# Altium schematic sheet Isolated-Power-Section.SchDoc
size A4; DocumentNumber: 3; SheetNumber: 3; SheetTotal: 10
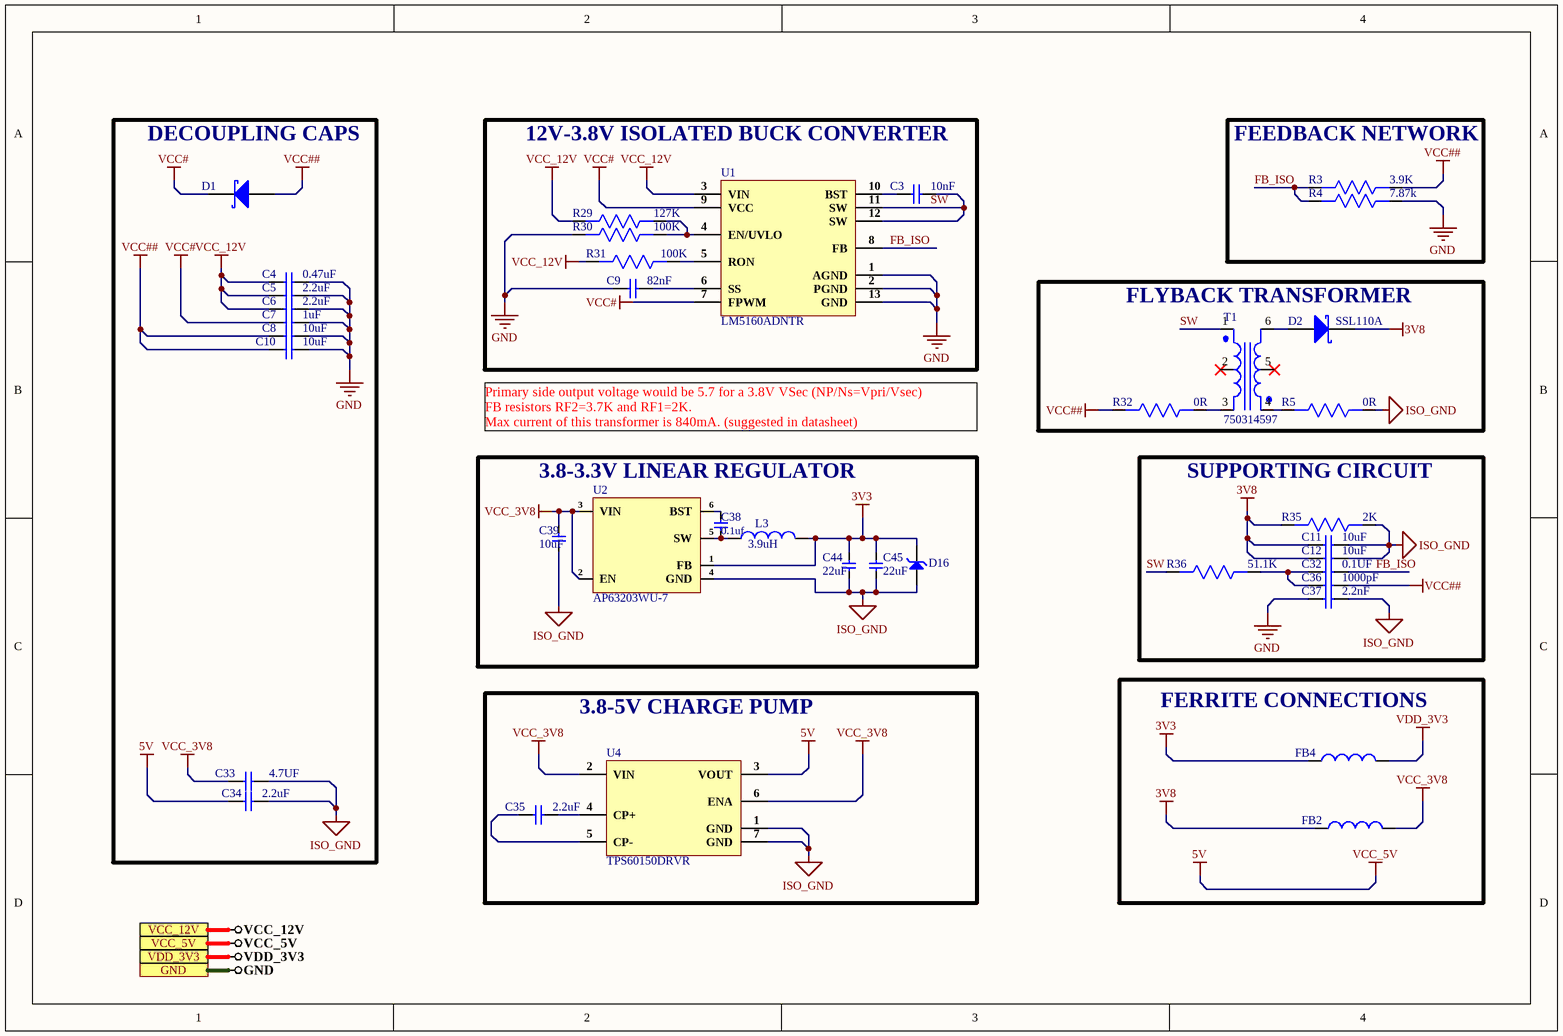
[diagram p0: Isolated-Power-Section.SchDoc]

## Parts
C3  10nF  [Cap 0402]
C4  0.47uF  [Cap 0402]
C5  2.2uF  [Cap 0603]
C6  2.2uF  [Cap 0603]
C7  1uF  [Cap 0603]
C8  10uF  [Cap 0603]
C9  82nF  [Cap 0603]
C10  10uF  [Cap 0603]
C11  10uF  [Cap 0603]
C12  10uF  [Cap 0603]
C32  0.1UF  [Cap 0402]
C33  4.7UF  [Cap 0603]
C34  2.2uF  [Cap 0603]
C35  2.2uF  [Cap 0603]
C36  1000pF  [Cap 0402]
C37  2.2nF  [Cap 0603]
C38  0.1uf  [Cap-0402]
C39  10uF  [Cap-0603]
C44  22uF  [Cap-0805]
C45  22uF  [Cap-0805]
D1  CUS10S30,H3F  [CUS10S30,H3F]  (value not drawn)
D2  SSL110A  [SMA]
D16  MSP3V3HM3/89A  [MicroSMP]  (value not drawn)
FB2  MPZ1608S121ATDH5  [MPZ1608S121ATDH5]  (value not drawn)
FB4  MPZ1608S121ATDH5  [MPZ1608S121ATDH5]  (value not drawn)
L3  3.9uH  [FNR3015S3R9MT]
R3  3.9K  [Res0603]
R4  7.87k  [Res0603]
R5  0R  [Res0603]
R29  127K  [Res0603]
R30  100K  [Res0603]
R31  100K  [Res0603]
R32  0R  [Res0603]
R35  2K  [Res0603]
R36  51.1K  [Res0603]
T1  750314597  [750314597]
U1  LM5160ADNTR  [LM5160ADNTR]
U2  AP63203WU-7  [TSOT-23-6]
U4  TPS60150DRVR  [TPS60150DRVR]

## Blocks framed on the sheet
DECOUPLING CAPS: C4-C8 C10 C33 C34 D1
12V-3.8V ISOLATED BUCK CONVERTER: C3 C9 R29-R31 U1
FEEDBACK NETWORK: R3 R4
FLYBACK TRANSFORMER: D2 R5 R32 T1
3.8-3.3V LINEAR REGULATOR: C38 C39 C44 C45 D16 L3 U2
SUPPORTING CIRCUIT: C11 C12 C32 C36 C37 R35 R36
3.8-5V CHARGE PUMP: C35 U4
FERRITE CONNECTIONS: FB2 FB4

## Ports
GND, VCC_5V, VCC_12V, VDD_3V3

## Nets
3V3: C44.2 C45.2 D16.2(K) FB4.1 L3.2 U2.1(FB)
3V8: C11.1 C12.1 D2.1(K) FB2.1 R35.2
5V: C34.1 U4.3(VOUT) ; port VCC_5V  [also labelled VCC_5V]
GND: C4.2 C5.2 C6.2 C7.2 C8.2 C9.1 C10.2 C37.1 R4.1 R30.2 U1.1(AGND) U1.2(PGND) U1.13(GND) ; port GND
ISO_GND: C11.2 C12.2 C33.2 C34.2 C37.2 C39.1 C44.1 C45.1 D16.1(A) R5.1 R35.1 U2.4(GND) U4.1(GND) U4.7(GND)
VCC#: C7.1 D1.1(K) U1.7(FPWM) U1.9(VCC)
VCC##: C8.1 C10.1 C36.2 D1.2(A) R3.1 R32.2
VCC_3V8: C33.1 C39.2 FB2.2 U2.2(EN) U2.3(VIN) U4.2(VIN) U4.6(ENA)
VCC_12V: C4.1 C5.1 C6.1 R29.2 R31.2 U1.3(VIN) ; port VCC_12V
VDD_3V3: FB4.2 ; port VDD_3V3
FB_ISO: C32.2 R3.2 R4.2 U1.8(FB)
SW: C3.2 R36.2 T1.1(PRI_1) U1.11(SW) U1.12(SW)
NetC3_1: C3.1 U1.10(BST)
NetC9_2: C9.2 U1.6(SS)
NetC32_1: C32.1 C36.1 R36.1
NetC35_1: C35.1 U4.5(CP-)
NetC35_2: C35.2 U4.4(CP+)
NetC38_1: C38.1 L3.1 U2.5(SW)
NetC38_2: C38.2 U2.6(BST)
NetD2_2: D2.2(A) T1.6(SEC_2)
NetR5_2: R5.2 T1.4(SEC_1)
NetR29_1: R29.1 R30.1 U1.4(EN/UVLO)
NetR31_1: R31.1 U1.5(RON)
NetR32_1: R32.1 T1.3(PRI_2)

Not connected (* = marked no-connect by the designer): T1 2(NC)* 5(NC)*

## Notes on the sheet
- Primary side output voltage would be 5.7 for a 3.8V VSec (NP/Ns=Vpri/Vsec)
  FB resistors RF2=3.7K and RF1=2K.
  Max current of this transformer is 840mA. (suggested in datasheet)

## Library data of the parts
C3 = CC0402KRX7R8BB103: CAP CER 10000PF 25V X7R 0402; Manufacturer: Yageo; Tolerance: 10%; Supplier 1: Digi-Key; Manufacturer Part Number: CC0402KRX7R8BB103; Stock 1: 0; Pricing 1: 1=0.1, 10=0.021, 100=0.0093, 500=0.00666, 1000=0.00523, 2500=0.00476, 5000=0.00438 (USD); Mount: Surface Mount; Case/Package: 0402; Case Code (Metric): 1005; Case Code (Imperial): 0402; Min Operating Temperature: -55°C; Max Operating Temperature: 125°C; Capacitance: 10nF; Dielectric: X7R; Voltage Rating: 25V; Package Quantity: 1; Packaging: Tape and Reel; Voltage Rating (DC): 25V; Termination: SMD/SMT; Composition: Ceramic; Length: 1mm; Height: 0.5mm; Depth: 0.5mm; Width: 0.02inch; Thickness: 0.022inch; Radiation Hardening: No; REACH SVHC: Unknown; Lead Free: Lead Free; Halogen Free: Halogen Free; ComponentLink1URL: http://www.yageo.com/documents/recent/UPY-GPHC_X7R_6.3V-to-50V_18.pdf?src-supplier=Digi-Key; ComponentLink1Description: http://www.yageo.com/documents/recent/UPY-GPHC_X7R_6.3V-to-50V_18.pdf?src-supplier=Digi-Key; ComponentLink2URL: https://www.verical.com/server-webapp/html/getDatasheet?partID=375418&src-supplier=Verical; ComponentLink2Description: https://www.verical.com/server-webapp/html/getDatasheet?partID=375418&src-supplier=Verical; ComponentLink3URL: http://www.yageo.com/documents/recent/UPY-GPHC_X7R_6.3V-to-50V_8.pdf?src-supplier=Avnet; ComponentLink3Description: http://www.yageo.com/documents/recent/UPY-GPHC_X7R_6.3V-to-50V_8.pdf?src-supplier=Avnet; ComponentLink4URL: https://4donline.ihs.com/images/VipMasterIC/IC/YAGO/YAGO-S-A0003557223/YAGO-S-A0003557223-1.pdf?hkey=52A5661711E402568146F3353EA87419&src-supplier=Element14; ComponentLink4Description: https://4donline.ihs.com/images/VipMasterIC/IC/YAGO/YAGO-S-A0003557223/YAGO-S-A0003557223-1.pdf?hkey=52A5661711E402568146F3353EA87419&src-supplier=Element14; ComponentLink5URL: http://www.farnell.com/datasheets/2167236.pdf?src-supplier=Element14; ComponentLink5Description: http://www.farnell.com/datasheets/2167236.pdf?src-supplier=Element14; ComponentLink6URL: http://www.mouser.com/ds/2/447/Yageo_UPY-GP_NP0_16V-to-50V_9-358835.pdf?src-supplier=Mouser; ComponentLink6Description: http://www.mouser.com/ds/2/447/Yageo_UPY-GP_NP0_16V-to-50V_9-358835.pdf?src-supplier=Mouser; Supplier Part Number 1: 311-1337-1-ND
C4 = UMK105ABJ474KV-F: CAP CER 0.47UF 50V X5R 0402; Manufacturer: Taiyo Yuden; Capacitance: 470nF; Tolerance: 10%; Supplier 1: Digi-Key; Manufacturer Part Number: UMK105ABJ474KV-F; RoHS: Yes; Category: Ceramic Capacitors; Stock 1: 145003; Pricing 1: 1=0.24000, 10=0.16100, 50=0.09680, 100=0.08170, 500=0.05592, 1000=0.04946, 2500=0.04731, 5000=0.04301 (USD); Mount: Surface Mount; Case/Package: 0402; Case Code (Metric): 1005; Case Code (Imperial): 0402; Min Operating Temperature: -55°C; Max Operating Temperature: 85°C; Package Quantity: 10000; Packaging: Tape and Reel; Voltage Rating: 50V; Voltage Rating (DC): 50V; Dielectric: X5R; Termination: SMD/SMT; Length: 0.039inch; Width: 0.02inch; Height: 0.5mm; Thickness: 0.022inch; Lead Free: Lead Free; RoHS Compliant: Yes; ComponentLink1URL: https://datasheet.ciiva.com/30249/584umk105abj474kv-f-30249824.pdf?src-supplier=Onlinecomponents.com; ComponentLink1Description: https://datasheet.ciiva.com/30249/584umk105abj474kv-f-30249824.pdf?src-supplier=Onlinecomponents.com; ComponentLink2URL: https://datasheet.ciiva.com/24370/10umk105abj474kv-f-24370678.pdf?src-supplier=Onlinecomponents.com; ComponentLink2Description: https://datasheet.ciiva.com/24370/10umk105abj474kv-f-24370678.pdf?src-supplier=Onlinecomponents.com; ComponentLink3URL: https://datasheet.ciiva.com/18697/mlcc-all-e-18697429.pdf?src-supplier=Digi-Key; ComponentLink3Description: https://datasheet.ciiva.com/18697/mlcc-all-e-18697429.pdf?src-supplier=Digi-Key; ComponentLink4URL: https://datasheet.ciiva.com/18697/mlcc-all-e-18697430.pdf?src-supplier=Digi-Key; ComponentLink4Description: https://datasheet.ciiva.com/18697/mlcc-all-e-18697430.pdf?src-supplier=Digi-Key; ComponentLink5URL: https://datasheet.ciiva.com/18697/mlcc-all-e-18697431.pdf?src-supplier=Digi-Key; ComponentLink5Description: https://datasheet.ciiva.com/18697/mlcc-all-e-18697431.pdf?src-supplier=Digi-Key; Supplier Part Number 1: 587-3497-1-ND
C5 C6 C34 C35 = GRM188R6YA225KA12D: CAP, 2.2µF, 35V, 10%, X5R, 0603; Manufacturer: Murata; Material: Ceramic; Supplier 1: Digi-Key; Manufacturer Part Number: GRM188R6YA225KA12D; RoHS: Yes; Category: Ceramic Capacitors; Stock 1: 81665; Pricing 1: 1=0.21000, 10=0.14100, 50=0.08480, 100=0.07170, 500=0.04904, 1000=0.04338 (USD); Mount: Surface Mount; Case/Package: 0603; Case Code (Metric): 1608; Case Code (Imperial): 0603; Weight: 0.000222oz; Min Operating Temperature: -55°C; Max Operating Temperature: 85°C; Package Quantity: 4000; Packaging: Tape and Reel; Capacitance: 2.2uF; Tolerance: 10%; Voltage Rating: 35V; Dielectric: X5R; Voltage: 35V; Termination: SMD/SMT; Voltage Rating (DC): 35V; Series: GRM; Length: 1.6mm; Width: 0.8mm; Height: 0.8mm; Thickness: 0.035inch; Depth: 0.8mm; REACH SVHC: No SVHC; Lead Free: Lead Free; RoHS Compliant: Yes; ComponentLink1URL: https://datasheet.ciiva.com/14906/partnumbering-e-01-14906490.pdf?src-supplier=Digi-Key; ComponentLink1Description: https://datasheet.ciiva.com/14906/partnumbering-e-01-14906490.pdf?src-supplier=Digi-Key; ComponentLink2URL: https://datasheet.ciiva.com/14906/partnumbering-e-01-14906491.pdf?src-supplier=Digi-Key; ComponentLink2Description: https://datasheet.ciiva.com/14906/partnumbering-e-01-14906491.pdf?src-supplier=Digi-Key; ComponentLink3URL: https://datasheet.ciiva.com/14906/partnumbering-e-01-14906492.pdf?src-supplier=Digi-Key; ComponentLink3Description: https://datasheet.ciiva.com/14906/partnumbering-e-01-14906492.pdf?src-supplier=Digi-Key; Supplier Part Number 1: 490-7204-1-ND
C7 = CC0603KRX5R8BB105: CAP CER 1UF 25V X5R 0603; Manufacturer: Yageo; Tolerance: 10%; Supplier 1: Digi-Key; Manufacturer Part Number: CC0603KRX5R8BB105; RoHS: Yes; Category: Ceramic Capacitors; Stock 1: 919939; Pricing 1: 1=0.12000, 10=0.08400, 50=0.04760, 100=0.03940, 500=0.02764, 1000=0.02288 (USD); Mount: Surface Mount; Case/Package: 0603; Number of Pins: 2; Case Code (Metric): 1608; Case Code (Imperial): 0603; Min Operating Temperature: -55°C; Max Operating Temperature: 85°C; Capacitance: 1uF; Dielectric: X5R; Package Quantity: 1; Voltage Rating: 25V; Packaging: Tape and Reel; Termination: SMD/SMT; Voltage Rating (DC): 25V; Series: CC; Construction: Flat; Length: 1.6mm; Width: 0.031inch; Height: 0.8mm; Thickness: 0.035inch; Depth: 0.8mm; Radiation Hardening: No; REACH SVHC: No SVHC; Lead Free: Lead Free; Halogen Free: Halogen Free; RoHS Compliant: Yes; ComponentLink1URL: https://datasheet.ciiva.com/176/mlccorderingcode-176785.pdf?src-supplier=Digi-Key; ComponentLink1Description: https://datasheet.ciiva.com/176/mlccorderingcode-176785.pdf?src-supplier=Digi-Key; ComponentLink2URL: https://datasheet.ciiva.com/176/mlccorderingcode-176786.pdf?src-supplier=Digi-Key; ComponentLink2Description: https://datasheet.ciiva.com/176/mlccorderingcode-176786.pdf?src-supplier=Digi-Key; ComponentLink3URL: https://datasheet.ciiva.com/176/mlccorderingcode-176787.pdf?src-supplier=Digi-Key; ComponentLink3Description: https://datasheet.ciiva.com/176/mlccorderingcode-176787.pdf?src-supplier=Digi-Key; ComponentLink4URL: https://datasheet.ciiva.com/17436/upy-gphc-x5r-4v-to-50v-12-17436952.pdf?src-supplier=Avnet+Europe; ComponentLink4Description: https://datasheet.ciiva.com/17436/upy-gphc-x5r-4v-to-50v-12-17436952.pdf?src-supplier=Avnet+Europe; ComponentLink5URL: https://datasheet.ciiva.com/7978/1525783-7978171.pdf?src-supplier=Element14; ComponentLink5Description: https://datasheet.ciiva.com/7978/1525783-7978171.pdf?src-supplier=Element14; ComponentLink6URL: https://datasheet.ciiva.com/11586/upy-gphc-x5r-4v-to-50v-12-11586318.pdf?src-supplier=Avnet; ComponentLink6Description: https://datasheet.ciiva.com/11586/upy-gphc-x5r-4v-to-50v-12-11586318.pdf?src-supplier=Avnet; Supplier Part Number 1: 311-1445-1-ND
C8 C10-C12 = GRM188R6YA106MA73D: 10uF 35V X5R 20% Pad SMD 0603; Manufacturer: Murata; Supplier 1: Arrow Electronics; Manufacturer Part Number: GRM188R6YA106MA73D; RoHS: Yes; Category: Ceramic Capacitors; Stock 1: 37601; Pricing 1: 1=0.36650, 10=0.23380, 25=0.23160, 100=0.15050, 250=0.14890, 500=0.10700, 1000=0.09270, 3000=0.08640, 6000=0.07720, 15000=0.07140, 30000=0.05840 (USD); Mount: Surface Mount; Case/Package: 0603; Case Code (Metric): 1608; Case Code (Imperial): 0603; Min Operating Temperature: -55°C; Max Operating Temperature: 85°C; Packaging: Tape and Reel; Capacitance: 10uF; Voltage Rating: 35V; Tolerance: 20%; Voltage Rating (DC): 35V; Dielectric: X5R; Length: 0.063inch; Width: 0.031inch; Thickness: 0.039inch; RoHS Compliant: Yes; ComponentLink1URL: http://search.murata.co.jp/Ceramy/image/img/A01X/G101/ENG/GRM188R6YA106MA73-01.pdf?src-supplier=Future+Electronics; ComponentLink1Description: http://search.murata.co.jp/Ceramy/image/img/A01X/G101/ENG/GRM188R6YA106MA73-01.pdf?src-supplier=Future+Electronics; ComponentLink2URL: http://search.murata.co.jp/Ceramy/image/img/A01X/G101/ENG/GRM188R6YA106MA73-01.pdf?src-supplier=Digi-Key; ComponentLink2Description: http://search.murata.co.jp/Ceramy/image/img/A01X/G101/ENG/GRM188R6YA106MA73-01.pdf?src-supplier=Digi-Key; ComponentLink3URL: https://www.murata.com/~/media/webrenewal/support/library/catalog/products/capacitor/mlcc/c02e.ashx?la=en-us&src-supplier=Digi-Key; ComponentLink3Description: https://www.murata.com/~/media/webrenewal/support/library/catalog/products/capacitor/mlcc/c02e.ashx?la=en-us&src-supplier=Digi-Key; ComponentLink4URL: http://search.murata.co.jp/Ceramy/image/img/A01X/G101/ENG/GRM188R6YA106MA73-01.pdf?src-supplier=Mouser; ComponentLink4Description: http://search.murata.co.jp/Ceramy/image/img/A01X/G101/ENG/GRM188R6YA106MA73-01.pdf?src-supplier=Mouser; ComponentLink5URL: http://search.murata.co.jp/Ceramy/image/img/A01X/G101/ENG/GRM188R6YA106MA73-01.pdf?src-supplier=TTI; ComponentLink5Description: http://search.murata.co.jp/Ceramy/image/img/A01X/G101/ENG/GRM188R6YA106MA73-01.pdf?src-supplier=TTI; Supplier Part Number 1: GRM188R6YA106MA73D
C9 = CC0603KRX7R9BB823: CAP CER 0.082UF 50V X7R 0603; Manufacturer: Yageo; Tolerance: 10%; Supplier 1: Newark; Manufacturer Part Number: CC0603KRX7R9BB823; RoHS: Yes; Category: Ceramic Capacitors; Stock 1: 40000; Pricing 1: 1=0.01500, 4000=0.01400, 8000=0.01400 (USD); Mount: Surface Mount; Case/Package: 0603; Case Code (Imperial): 0603; Case Code (Metric): 1608; Weight: 7.1E-05oz; Min Operating Temperature: -55°C; Max Operating Temperature: 125°C; Packaging: Tape and Reel; Capacitance: 82nF; Voltage Rating (DC): 50V; Dielectric: X7R; Voltage Rating: 50V; Termination: SMD/SMT; Resistor Type: Ceramic; Series: CC; Length: 1.6mm; Width: 0.031inch; Thickness: 0.035inch; Depth: 0.8mm; Radiation Hardening: No; Lead Free: Lead Free; Halogen Free: Halogen Free; RoHS Compliant: Yes; ComponentLink1URL: https://datasheet.ciiva.com/13264/upy-gphc-x7r-6-3v-to-50v-8-12304-13264057.pdf?src-supplier=Mouser; ComponentLink1Description: https://datasheet.ciiva.com/13264/upy-gphc-x7r-6-3v-to-50v-8-12304-13264057.pdf?src-supplier=Mouser; Supplier Part Number 1: 69AH7269
C32 = CL05B104KB54PNC: CAP CER 0.1UF 50V X7R 0402; Manufacturer: Samsung; Supplier 1: Digi-Key; Manufacturer Part Number: CL05B104KB54PNC; Stock 1: 8594; Pricing 1: 1=0.1, 10=0.067, 50=0.0366, 100=0.0299, 500=0.02138, 1000=0.01681, 2500=0.01528, 5000=0.01406 (USD); Supplier Part Number 1: 1276-CL05B104KB54PNCDKR-ND
C33 = CL10A475KA8NQNC: CAP CER 4.7UF 25V X5R 0603; Manufacturer: Samsung; Tolerance: 10%; Supplier 1: Digi-Key; Manufacturer Part Number: CL10A475KA8NQNC; Stock 1: 2252340; Pricing 1: 1=0.37, 10=0.255, 100=0.1528, 500=0.11456, 1000=0.09675 (USD); Mount: Surface Mount; Case/Package: 0603; Case Code (Metric): 1608; Case Code (Imperial): 0603; Contact Plating: Tin; Min Operating Temperature: -55°C; Max Operating Temperature: 85°C; Package Quantity: 1; Packaging: Tape and Reel; Capacitance: 4.7uF; Voltage Rating: 25V; Dielectric: X5R; Termination: Wraparound; Length: 1.6mm; Width: 0.031inch; Thickness: 0.035inch; Depth: 0.8mm; Lead Free: Lead Free; ComponentLink1URL: http://www.samsungsem.com/kr/support/product-search/mlcc/CL10A475KA8NQNC.jsp?src-supplier=Digi-Key; ComponentLink1Description: http://www.samsungsem.com/kr/support/product-search/mlcc/CL10A475KA8NQNC.jsp?src-supplier=Digi-Key; Supplier Part Number 1: 1276-1900-1-ND
C36 = 885012205080: CAP CER 1000PF 100V X7R 0402; Manufacturer: Wurth Electronics; Supplier 1: Digi-Key; Manufacturer Part Number: 885012205080; RoHS: Yes; Stock 1: 13604; Pricing 1: 1=0.10000, 10=0.01900, 100=0.01730, 500=0.01532 (USD); ComponentLink1URL: https://katalog.we-online.de/pbs/datasheet/885012205080.pdf?src-supplier=Digi-Key; ComponentLink1Description: https://katalog.we-online.de/pbs/datasheet/885012205080.pdf?src-supplier=Digi-Key; Supplier Part Number 1: 732-12243-1-ND
C37 = CC0603KRX7R9BB222: CAP CER 2200PF 50V X7R 0603; Manufacturer: Yageo; Tolerance: 10%; Insulation Resistance: 10GR; Dissipation Factor: 2.5%; Supplier 1: RSComponents; Manufacturer Part Number: CC0603KRX7R9BB222; RoHS: Yes; Category: Ceramic Capacitors; Stock 1: 1; Pricing 1: 4000=0.00500 (USD); Mount: Surface Mount; Case/Package: 0603; Number of Pins: 2; Case Code (Metric): 1608; Case Code (Imperial): 0603; Min Operating Temperature: -55°C; Max Operating Temperature: 125°C; Capacitance: 2.2nF; Dielectric: X7R; Package Quantity: 1; Voltage Rating: 50V; Packaging: Tape and Reel; Voltage Rating (DC): 50V; Termination: SMD/SMT; Resistor Type: Ceramic; Voltage: 50V; Series: CC; Length: 1.6mm; Width: 0.031inch; Height: 0.8mm; Thickness: 0.035inch; Depth: 0.8mm; Radiation Hardening: No; REACH SVHC: No SVHC; Lead Free: Lead Free; Halogen Free: Halogen Free; RoHS Compliant: Yes; ComponentLink1URL: https://datasheet.ciiva.com/23768/1079489-23768004.pdf?src-supplier=Newark; ComponentLink1Description: https://datasheet.ciiva.com/23768/1079489-23768004.pdf?src-supplier=Newark; ComponentLink2URL: https://datasheet.ciiva.com/11788/0900766b8079c870-11788403.pdf?src-supplier=RSComponents; ComponentLink2Description: https://datasheet.ciiva.com/11788/0900766b8079c870-11788403.pdf?src-supplier=RSComponents; ComponentLink3URL: https://datasheet.ciiva.com/26862/getdatasheetpartid-403587-26862854.pdf?src-supplier=Verical; ComponentLink3Description: https://datasheet.ciiva.com/26862/getdatasheetpartid-403587-26862854.pdf?src-supplier=Verical; ComponentLink4URL: https://datasheet.ciiva.com/8033/70765-8033863.pdf?src-supplier=Element14; ComponentLink4Description: https://datasheet.ciiva.com/8033/70765-8033863.pdf?src-supplier=Element14; ComponentLink5URL: https://datasheet.ciiva.com/7978/1489800-7978172.pdf?src-supplier=Element14; ComponentLink5Description: https://datasheet.ciiva.com/7978/1489800-7978172.pdf?src-supplier=Element14; ComponentLink6URL: https://datasheet.ciiva.com/28450/1489800-28450632.pdf?src-supplier=Element14; ComponentLink6Description: https://datasheet.ciiva.com/28450/1489800-28450632.pdf?src-supplier=Element14; ComponentLink7URL: https://datasheet.ciiva.com/155/mlccorderingcode-155921.pdf?src-supplier=Digi-Key; ComponentLink7Description: https://datasheet.ciiva.com/155/mlccorderingcode-155921.pdf?src-supplier=Digi-Key; ComponentLink8URL: https://datasheet.ciiva.com/155/mlccorderingcode-155920.pdf?src-supplier=Digi-Key; ComponentLink8Description: https://datasheet.ciiva.com/155/mlccorderingcode-155920.pdf?src-supplier=Digi-Key; ComponentLink9URL: https://datasheet.ciiva.com/155/mlccorderingcode-155922.pdf?src-supplier=Digi-Key; ComponentLink9Description: https://datasheet.ciiva.com/155/mlccorderingcode-155922.pdf?src-supplier=Digi-Key; ComponentLink10URL: https://datasheet.ciiva.com/8033/1489800-8033864.pdf?src-supplier=Element14; ComponentLink10Description: https://datasheet.ciiva.com/8033/1489800-8033864.pdf?src-supplier=Element14; ComponentLink11URL: https://datasheet.ciiva.com/8033/1489800-8033862.pdf?src-supplier=Element14; ComponentLink11Description: https://datasheet.ciiva.com/8033/1489800-8033862.pdf?src-supplier=Element14; ComponentLink12URL: https://datasheet.ciiva.com/16625/upy-gphc-x7r-6-3v-to-50v-8-16625531.pdf?src-supplier=Avnet+Europe; ComponentLink12Description: https://datasheet.ciiva.com/16625/upy-gphc-x7r-6-3v-to-50v-8-16625531.pdf?src-supplier=Avnet+Europe; Supplier Part Number 1: 6169509
C38 = GRM155R62A104KE14D: CAP CER 0.1UF 100V X5R 0402; Manufacturer: Murata; Capacitance: 100nF; Tolerance: 10%; Item Type: Capacitor; Supplier 1: Arrow Electronics; Manufacturer Part Number: GRM155R62A104KE14D; RoHS: Yes; Category: Ceramic Capacitors; Stock 1: 870000; Pricing 1: 10000=0.00500, 20000=0.00410, 30000=0.00390, 50000=0.00370, 100000=0.00300 (USD); Mount: Surface Mount; Case/Package: 0402; Case Code (Metric): 1005; Case Code (Imperial): 0402; Weight: 0.000212oz; Min Operating Temperature: -55°C; Max Operating Temperature: 85°C; Packaging: Tape and Reel; Voltage Rating: 100V; Dielectric: X5R; Termination: SMD/SMT; Voltage Rating (DC): 100V; Package Quantity: 10000; Series: GRM; Length: 0.039inch; Width: 0.02inch; Height: 0.5mm; Thickness: 0.022inch; Reach SVHC Compliant: Yes; Lead Free: Lead Free; RoHS Compliant: Yes; ComponentLink1URL: http://www.farnell.com/datasheets/2079151.pdf?src-supplier=Farnell; ComponentLink1Description: http://www.farnell.com/datasheets/2079151.pdf?src-supplier=Farnell; ComponentLink2URL: http://www.mouser.com/ds/2/281/c02e-2905.pdf?src-supplier=Mouser; ComponentLink2Description: http://www.mouser.com/ds/2/281/c02e-2905.pdf?src-supplier=Mouser; ComponentLink3URL: http://www.farnell.com/datasheets/2079151.pdf?src-supplier=Element14; ComponentLink3Description: http://www.farnell.com/datasheets/2079151.pdf?src-supplier=Element14; ComponentLink4URL: http://search.murata.co.jp/Ceramy/image/img/A01X/G101/ENG/GRM155R62A104KE14-01.pdf?src-supplier=Digi-Key; ComponentLink4Description: http://search.murata.co.jp/Ceramy/image/img/A01X/G101/ENG/GRM155R62A104KE14-01.pdf?src-supplier=Digi-Key; ComponentLink5URL: http://www.farnell.com/datasheets/2079151.pdf?src-supplier=Newark; ComponentLink5Description: http://www.farnell.com/datasheets/2079151.pdf?src-supplier=Newark; Supplier Part Number 1: GRM155R62A104KE14D; LCSC Part Number: C162178
C39 = C1608X5R1E106M080AC: CAP CER 10UF 25V X5R 0603; Manufacturer: TDK; Dielectric Material: Ceramic; Tolerance: 20%; Item Type: Capacitor; Supplier 1: Digi-Key; Manufacturer Part Number: C1608X5R1E106M080AC; Stock 1: 61681; Pricing 1: 1=0.96, 10=0.704, 100=0.483, 500=0.38238, 1000=0.322 (USD); Mount: Surface Mount; Case/Package: 0603; Weight: 7.1E-05oz; Case Code (Imperial): 0603; Case Code (Metric): 1608; Min Operating Temperature: -55°C; Max Operating Temperature: 85°C; Capacitance: 10uF; Packaging: Tape and Reel; Voltage Rating: 25V; Voltage Rating (DC): 25V; Termination: SMD/SMT; Package Quantity: 1; Dielectric: X5R; Composition: Ceramic; Length: 1.6mm; Height: 0.8mm; Width: 0.8mm; Thickness: 0.039inch; Depth: 0.8mm; Lead Free: Lead Free; REACH SVHC: No SVHC; Supplier Part Number 1: 445-9015-1-ND; LCSC Part Number: C2168289
C44 C45 = C2012X5R1V226MT000E: CAP CER 22UF 35V X5R 0805; Manufacturer: TDK Corporation; Item Type: Capacitor; Manufacturer Part Number: C2012X5R1V226MT000E; Package: 0805; ComponentLink1Description: LCSC; ComponentLink1URL: https://www.lcsc.com/product-detail/Multilayer-Ceramic-Capacitors-MLCC-SMD-SMT_TDK-C2012X5R1V226M125AC_C2179409.html; LCSC Part Number: C338080
D1 = CUS10S30,H3F: Diode Schottky 30V 1A Surface Mount USC; Manufacturer: Toshiba; Max Reverse Current: 500uA; Peak Non-Repetitive Surge Current: 5A; Element Configuration: Single; Supplier 1: Avnet; Manufacturer Part Number: CUS10S30,H3F; RoHS: Yes; Category: Rectifier Diodes; Stock 1: 9000; Pricing 1: 3000=0.04896, 6000=0.04768, 12000=0.04544, 18000=0.04416, 24000=0.04320, 30000=0.04192, 300000=0.04096 (USD); Mount: Surface Mount; Case/Package: SOD; Number of Pins: 2; Contact Plating: Tin,Silver; Min Operating Temperature: -55°C; Max Operating Temperature: 125°C; Packaging: Cut Tape; Average Rectified Current: 1A; Max Reverse Voltage (DC): 30V; RoHS Compliant: No; ComponentLink1URL: https://toshiba.semicon-storage.com/info/docget.jsp?did=14077&prodName=CUS10S30&src-supplier=Digi-Key; ComponentLink1Description: https://toshiba.semicon-storage.com/info/docget.jsp?did=14077&prodName=CUS10S30&src-supplier=Digi-Key; ComponentLink2URL: http://toshiba.semicon-storage.com/info/docget.jsp?did=14077&prodName=CUS10S30&src-supplier=Avnet; ComponentLink2Description: http://toshiba.semicon-storage.com/info/docget.jsp?did=14077&prodName=CUS10S30&src-supplier=Avnet; ComponentLink3URL: http://toshiba.semicon-storage.com/info/lookup.jsp?pid=CUS10S30&amp;lang=en&src-supplier=Mouser; ComponentLink3Description: http://toshiba.semicon-storage.com/info/lookup.jsp?pid=CUS10S30&amp;lang=en&src-supplier=Mouser; Supplier Part Number 1: CUS10S30,H3F
D2 = SSL110A: 500μA@100V 100V Single 600mV@1A 1A SMA Schottky Barrier Diodes (SBD) ROHS; Manufacturer: Yangzhou; Manufacturer Part No: SSL110A; Package: SMA
D16 = MSP3V3HM3/89A: TVS DIODE 3.3VWM 11.5VC MICROSMP; Direction: Unidirectional; Operating Supply Voltage: 3.3V; Max Surge Current: 75A; Breakdown Voltage: 4.1V; Clamping Voltage: 11V; Peak Pulse Power: 150W; Number of Unidirectional Channels: 1; Power Line Protection: No; Peak Pulse Current: 87A; Test Current: 1mA; Max Reverse Leakage Current: 200uA; Diode Type: ZENER; LCSC Part Number: C241899; Item Type: TVS Diode; ComponentLink1Description: LCSC; Supplier: Mouser; Supplier Part Number: 625-MSP3V3HM3; RoHS: Yes; Category: TVS Diodes; Stock: 15021; Pricing: 1=0.39, 10=0.313, 50=0.313, 100=0.165, 1000=0.068, 10000=0.05 (USD); Mounting Technology: Surface Mount; Min Operating Temperature: -55°C; Max Operating Temperature: 150°C; Packaging: Tape and Reel; Package Quantity: 4500; Polarity: Unidirectional; Reverse Standoff Voltage: 3.3V; Min Breakdown Voltage: 4.1V; Series: Automotive, AEC-Q101, TransZorb®, eSMP™; RoHS Compliant: Yes; ComponentLink2URL: https://datasheet.ciiva.com/14080/msp3v3-14080471.pdf?src-supplier=Digi-Key; ComponentLink2Description: https://datasheet.ciiva.com/14080/msp3v3-14080471.pdf?src-supplier=Digi-Key
FB2 FB4 = MPZ1608S121ATDH5: Ferrite Beads Multi-Layer 120Ohm 25% 100MHz 2A 45mOhm DCR 0603 Automotive T/R; Manufacturer: TDK; Number of Lines: 1; DC Resistance (DCR): 45mR; Impedance: 120R; Supplier 1: Digi-Key; Manufacturer Part Number: MPZ1608S121ATDH5; RoHS: Yes; Category: Ferrite Beads and Chips; Pricing 1: 1=0.11000, 10=0.08600, 25=0.07720, 50=0.05660, 100=0.04890, 250=0.03860, 500=0.03260, 1000=0.02746 (USD); Mount: Surface Mount; Case/Package: 0603; Case Code (Metric): 1608; Case Code (Imperial): 0603; Weight: 7.1E-05oz; Min Operating Temperature: -55°C; Max Operating Temperature: 125°C; Package Quantity: 4000; Packaging: Tape and Reel; Max Current Rating: 2A; Termination: SMD/SMT; Max DC Current: 2A; Tolerance: 25%; Test Frequency: 100MHz; Length: 0.063inch; Width: 0.031inch; Height: 0.03inch; Ratings: AEC-Q200; RoHS Compliant: Yes; ComponentLink1URL: https://media.digikey.com/pdf/Data%20Sheets/TDK%20PDFs/MPZ_Series_Br.pdf?src-supplier=Digi-Key; ComponentLink1Description: https://media.digikey.com/pdf/Data%20Sheets/TDK%20PDFs/MPZ_Series_Br.pdf?src-supplier=Digi-Key; ComponentLink2URL: http://www.mouser.com/ds/2/400/eads_commercial_power_mpz1608_en-923650.pdf?src-supplier=Mouser; ComponentLink2Description: http://www.mouser.com/ds/2/400/eads_commercial_power_mpz1608_en-923650.pdf?src-supplier=Mouser; ComponentLink3URL: https://product.tdk.com/info/en/catalog/datasheets/beads_automotive_power_mpz1608_en.pdf?src-supplier=Digi-Key; ComponentLink3Description: https://product.tdk.com/info/en/catalog/datasheets/beads_automotive_power_mpz1608_en.pdf?src-supplier=Digi-Key; Supplier Part Number 1: 445-172891-6-ND
L3 = FNR3015S3R9MT: 1.5A 3.9uH ±20% 1.4A SMD,3x3mm Power Inductors ROHS; Manufacturer: cjiang; Manufacturer Part Number: FNR3015S3R9MT; Package: SMD,3x3mm; LCSC Part Number: C167751; Item Type: Inductor; ComponentLink1Description: LCSC; ComponentLink1URL: https://www.lcsc.com/product-detail/Power-Inductors_cjiang-Changjiang-Microelectronics-Tech-FNR3015S3R9MT_C167751.html
R3 = RC0603FR-073K9L: Res 0603 3.9K Ohm 1% 0.1W(1/10W) ±100ppm/°C Pad SMD T/R; Manufacturer: Yageo; Resistance: 3.9kR; Power Rating: 100mW; Voltage Rating: 50V; Supplier 1: RSComponents; Manufacturer Part Number: RC0603FR-073K9L; RoHS: Yes; Category: Chip SMD Resistors; Stock 1: 100; Pricing 1: 500=0.00600, 1000=0.00500, 2500=0.00500, 5000=0.00400 (GBP); Case/Package: 0603; Number of Pins: 2; Case Code (Metric): 1608; Case Code (Imperial): 0603; Size Code: 0603; Min Operating Temperature: -55°C; Max Operating Temperature: 155°C; Package Quantity: 1; Tolerance: 1%; Packaging: Tape and Reel; Voltage Rating (DC): 50V; Resistor Type: Thick Film; Number of Terminations: 2; Termination: SMD/SMT; Temperature Coefficient: 100ppm/°C; Max Power Dissipation: 100mW; Features: Moisture Resistant; Series: RC; Technology: THICK FILM; Resistance Tolerance: 1%; Construction: Rectangular; Length: 1.6mm; Width: 0.8mm; Height: 0.45mm; Depth: 0.8mm; REACH SVHC: No SVHC; Military Standard: Not; Lead Free: Lead Free; RoHS Compliant: Yes; ComponentLink1URL: https://datasheet.ciiva.com/11819/0900766b80f96399-11819346.pdf?src-supplier=RSComponents; ComponentLink1Description: https://datasheet.ciiva.com/11819/0900766b80f96399-11819346.pdf?src-supplier=RSComponents; ComponentLink2URL: https://datasheet.ciiva.com/2455/pyu-r-int-thick-7-2455362.pdf?src-supplier=Digi-Key; ComponentLink2Description: https://datasheet.ciiva.com/2455/pyu-r-int-thick-7-2455362.pdf?src-supplier=Digi-Key; ComponentLink3URL: https://datasheet.ciiva.com/2455/pyu-r-int-thick-7-2455363.pdf?src-supplier=Digi-Key; ComponentLink3Description: https://datasheet.ciiva.com/2455/pyu-r-int-thick-7-2455363.pdf?src-supplier=Digi-Key; ComponentLink4URL: https://datasheet.ciiva.com/2455/pyu-r-int-thick-7-2455364.pdf?src-supplier=Digi-Key; ComponentLink4Description: https://datasheet.ciiva.com/2455/pyu-r-int-thick-7-2455364.pdf?src-supplier=Digi-Key; ComponentLink5URL: https://datasheet.ciiva.com/7983/443971-7983640.pdf?src-supplier=Element14; ComponentLink5Description: https://datasheet.ciiva.com/7983/443971-7983640.pdf?src-supplier=Element14; ComponentLink6URL: https://datasheet.ciiva.com/12558/rc0603-272842-12558649.pdf?src-supplier=Mouser; ComponentLink6Description: https://datasheet.ciiva.com/12558/rc0603-272842-12558649.pdf?src-supplier=Mouser; ComponentLink7URL: https://datasheet.ciiva.com/7746/443971-7746347.pdf?src-supplier=Element14; ComponentLink7Description: https://datasheet.ciiva.com/7746/443971-7746347.pdf?src-supplier=Element14; ComponentLink8URL: https://datasheet.ciiva.com/7746/443971-7746348.pdf?src-supplier=Element14; ComponentLink8Description: https://datasheet.ciiva.com/7746/443971-7746348.pdf?src-supplier=Element14; ComponentLink9URL: https://datasheet.ciiva.com/15189/getdatasheetpartid-323794-15189725.pdf?src-supplier=Verical; ComponentLink9Description: https://datasheet.ciiva.com/15189/getdatasheetpartid-323794-15189725.pdf?src-supplier=Verical; Supplier Part Number 1: 1995566P
R4 = RS-03K7871FT: 100mW 50V ±1% ±100ppm/℃ -55℃~+155℃ 7.87kΩ 0603 Chip Resistor - Surface Mount ROHS; Manufacturer: FH; Manufacturer Part Number: RS-03K7871FT; Footprint: 0603; ComponentLink1Description: LCSC; ComponentLink1URL: https://lcsc.com/product-detail/Chip-span-style-background-color-ff0-Resistor-span-Surface-Mount_FH-Guangdong-Fenghua-Advanced-Tech-RS-03K7871FT_C322001.html
R5 R32 = RC0603FR-070RL: RES SMD 0R, 1%, 0.1W, 0603; Manufacturer: Yageo; Resistance: 0mR; Power Rating: 100mW; Voltage Rating (DC): 50V; Temperature Coefficient: 200ppm/°C; Current Rating: 1A; Working Voltage: 75V; Supplier 1: Arrow Electronics; Manufacturer Part Number: RC0603FR-070RL; RoHS: Yes; Category: Chip SMD Resistors; Stock 1: 1270000; Pricing 1: 5000=0.00320, 5000=0.00490, 50000=0.00450, 500000=0.00250, 2500000=0.00150 (USD); Case/Package: 0603; Number of Pins: 2; Contact Plating: Tin,Matte; Case Code (Metric): 1608; Case Code (Imperial): 0603; Min Operating Temperature: -55°C; Max Operating Temperature: 155°C; Resistor Type: Thick Film; Packaging: Tape and Reel; Tolerance: 1%; Package Quantity: 5000; Voltage Rating: 50V; Number of Terminations: 2; Termination: SMD/SMT; Max Power Dissipation: 100mW; Features: Moisture Resistant; Length: 1.6mm; Width: 0.031inch; Height: 0.45mm; Depth: 0.8mm; Radiation Hardening: No; REACH SVHC: No SVHC; Lead Free: Lead Free; Military Standard: Not; ComponentLink1URL: https://datasheet.ciiva.com/11808/0900766b80f96399-11808172.pdf?src-supplier=RSComponents; ComponentLink1Description: https://datasheet.ciiva.com/11808/0900766b80f96399-11808172.pdf?src-supplier=RSComponents; ComponentLink2URL: https://datasheet.ciiva.com/5558/rc0603-272842-5558341.pdf?src-supplier=Mouser; ComponentLink2Description: https://datasheet.ciiva.com/5558/rc0603-272842-5558341.pdf?src-supplier=Mouser; ComponentLink3URL: https://datasheet.ciiva.com/46382/443971-46382072.pdf?src-supplier=Element14; ComponentLink3Description: https://datasheet.ciiva.com/46382/443971-46382072.pdf?src-supplier=Element14; ComponentLink4URL: https://datasheet.ciiva.com/29721/pyu-r-int-thick-7-29721178.pdf?src-supplier=Digi-Key; ComponentLink4Description: https://datasheet.ciiva.com/29721/pyu-r-int-thick-7-29721178.pdf?src-supplier=Digi-Key; ComponentLink5URL: https://datasheet.ciiva.com/5684/443971-5684699.pdf?src-supplier=Farnell; ComponentLink5Description: https://datasheet.ciiva.com/5684/443971-5684699.pdf?src-supplier=Farnell; ComponentLink6URL: https://datasheet.ciiva.com/7983/443971-7983627.pdf?src-supplier=Element14; ComponentLink6Description: https://datasheet.ciiva.com/7983/443971-7983627.pdf?src-supplier=Element14; ComponentLink7URL: https://datasheet.ciiva.com/29721/pyu-rc0603-51-rohs-l-4-29721179.pdf?src-supplier=Digi-Key; ComponentLink7Description: https://datasheet.ciiva.com/29721/pyu-rc0603-51-rohs-l-4-29721179.pdf?src-supplier=Digi-Key; ComponentLink8URL: https://datasheet.ciiva.com/22643/1868787-22643388.pdf?src-supplier=Element14; ComponentLink8Description: https://datasheet.ciiva.com/22643/1868787-22643388.pdf?src-supplier=Element14; Supplier Part Number 1: RC0603FR-070RL
R29 = RT0603FRE07127KL: RES SMD 127K OHM 1% 1/10W 0603; Manufacturer: Yageo; Power Rating: 100mW; Resistance: 127kR; Voltage Rating: 75V; Temperature Coefficient: 50ppm/°C; Voltage Rating (DC): 50V; Supplier 1: Mouser; Manufacturer Part Number: RT0603FRE07127KL; RoHS: Yes; Category: Chip SMD Resistors; Stock 1: 7346; Pricing 1: 1=0.19000, 10=0.05700, 50=0.05700, 100=0.02300, 1000=0.01100, 10000=0.00700 (USD); Case/Package: 0603; Case Code (Metric): 1608; Case Code (Imperial): 0603; Min Operating Temperature: -55°C; Max Operating Temperature: 125°C; Packaging: Tape and Reel; Tolerance: 1%; Package Quantity: 5000; Resistor Type: Thin Film; Termination: SMD/SMT; Number of Terminations: 2; Max Power Dissipation: 100mW; Series: RT; Length: 0.063inch; Width: 0.031inch; Height: 0.022inch; Lead Free: Lead Free; RoHS Compliant: Yes; ComponentLink1URL: https://datasheet.ciiva.com/2559/pyu-rt-1-to-0-05-rohs-l-5-2559509.pdf?src-supplier=Digi-Key; ComponentLink1Description: https://datasheet.ciiva.com/2559/pyu-rt-1-to-0-05-rohs-l-5-2559509.pdf?src-supplier=Digi-Key; Supplier Part Number 1: 603-RT0603FRE07127KL
R30 R31 = RC0603JR-07100KL: Res Thick Film 0603 100K Ohm 5% 1/10W 100ppm/C Molded SMD SMD Paper T/R; Manufacturer: Yageo; Resistance: 100kR; Temperature Coefficient: 100ppm/°C; Voltage Rating: 50V; Power Rating: 100mW; Supplier 1: Digi-Key; Manufacturer Part Number: RC0603JR-07100KL; RoHS: Yes; Category: Chip SMD Resistors; Stock 1: 1210037; Pricing 1: 1=0.10000, 10=0.02000, 100=0.00800, 1000=0.00360, 2500=0.00312 (USD); Case/Package: 0603; Number of Pins: 2; Contact Plating: Tin,Matte; Case Code (Imperial): 0603; Case Code (Metric): 1608; Size Code: 0603; Min Operating Temperature: -55°C; Max Operating Temperature: 155°C; Tolerance: 5%; Resistor Type: Thick Film; Packaging: Tape and Reel; Voltage Rating (DC): 50V; Termination: SMD/SMT; Features: Moisture Resistant; Series: RC; Max Power Dissipation: 100mW; Number of Terminations: 2; Resistance Tolerance: 5%; Width: 0.8mm; Radiation Hardening: No; REACH SVHC: No SVHC; Lead Free: Lead Free; RoHS Compliant: Yes; ComponentLink1URL: https://datasheet.ciiva.com/7746/443971-7746424.pdf?src-supplier=Element14; ComponentLink1Description: https://datasheet.ciiva.com/7746/443971-7746424.pdf?src-supplier=Element14; ComponentLink2URL: https://datasheet.ciiva.com/7983/443971-7983686.pdf?src-supplier=Element14; ComponentLink2Description: https://datasheet.ciiva.com/7983/443971-7983686.pdf?src-supplier=Element14; ComponentLink3URL: https://datasheet.ciiva.com/7746/443971-7746423.pdf?src-supplier=Element14; ComponentLink3Description: https://datasheet.ciiva.com/7746/443971-7746423.pdf?src-supplier=Element14; ComponentLink4URL: https://datasheet.ciiva.com/8887/pyu-rc0603-51-rohs-l-4-8887903.pdf?src-supplier=Avnet; ComponentLink4Description: https://datasheet.ciiva.com/8887/pyu-rc0603-51-rohs-l-4-8887903.pdf?src-supplier=Avnet; Supplier Part Number 1: 311-100KGRCT-ND
R35 = RC0603FR-072KL: RES SMD 2K OHM 1% 1/10W 0603; Manufacturer: Yageo; Resistance: 2kR; Temperature Coefficient: 100ppm/°C; Voltage Rating (DC): 50V; Power Rating: 100mW; Working Voltage: 75V; Supplier 1: Digi-Key; Manufacturer Part Number: RC0603FR-072KL; Stock 1: 8782961; Pricing 1: 1=0.1, 10=0.023, 100=0.0094, 1000=0.00421, 2500=0.00366 (USD); Case/Package: 0603; Number of Pins: 2; Case Code (Metric): 1608; Case Code (Imperial): 0603; Min Operating Temperature: -55°C; Max Operating Temperature: 155°C; Tolerance: 1%; Composition: Thick Film; Packaging: Tape and Reel; Voltage Rating: 50V; Package Quantity: 1; Number of Terminations: 2; Termination: SMD/SMT; Military Standard: Not; Max Power Dissipation: 100mW; Features: Moisture Resistant; Length: 1.6mm; Height: 0.45mm; Width: 0.031inch; Depth: 0.8mm; Lead Free: Lead Free; REACH SVHC: No SVHC; ComponentLink1URL: http://www.farnell.com/datasheets/2167052.pdf?src-supplier=Element14; ComponentLink1Description: http://www.farnell.com/datasheets/2167052.pdf?src-supplier=Element14; ComponentLink2URL: http://documents.rs-components.com/techlib://itc_doclist_GB.htm?stockno=5050139&src-supplier=RSComponents; ComponentLink2Description: http://documents.rs-components.com/techlib://itc_doclist_GB.htm?stockno=5050139&src-supplier=RSComponents; ComponentLink3URL: http://www.yageo.com/documents/recent/PYu-RC_Group_51_RoHS_L_10.pdf?src-supplier=Digi-Key; ComponentLink3Description: http://www.yageo.com/documents/recent/PYu-RC_Group_51_RoHS_L_10.pdf?src-supplier=Digi-Key; ComponentLink4URL: http://www.mouser.com/catalog/specsheets/RC0603.pdf?src-supplier=Mouser; ComponentLink4Description: http://www.mouser.com/catalog/specsheets/RC0603.pdf?src-supplier=Mouser; Supplier Part Number 1: 311-2.00KHRCT-ND
R36 = ERA3AEB5112V: Res SMD 0603 51.1K Ohm 0.1% 1/10W; Manufacturer: Panasonic; Manufacturer Part Number: ERA-3AEB5112V; Resistance: 51.1kR; Temperature Coefficient: 25ppm/°C; Power Rating: 100mW; Voltage Rating: 150V; Voltage Rating (DC): 75V; Supplier 1: Future Electronics; RoHS: Yes; Category: Chip SMD Resistors; Stock 1: 5000; Pricing 1: 5000=0.04010, 10000=0.03280, 15000=0.03250, 20000=0.03230, 25000=0.03210 (USD); Mount: Surface Mount; Case/Package: 0603; Number of Pins: 2; Contact Plating: Tin; Case Code (Metric): 1608; Case Code (Imperial): 0603; Min Operating Temperature: -55°C; Max Operating Temperature: 155°C; Tolerance: 0.1%; Resistor Type: Thin Film,Metal Film; Packaging: Tape and Reel; Package Quantity: 5000; Number of Terminations: 2; Max Power Dissipation: 100mW; Features: Automotive AEC-Q200; Length: 1.6mm; Width: 0.8mm; Height: 0.45mm; Depth: 0.8mm; Radiation Hardening: No; Military Standard: Not; Lead Free: Lead Free; ComponentLink1URL: https://datasheet.ciiva.com/11810/0900766b80eb1d8c-11810561.pdf?src-supplier=RSComponents; ComponentLink1Description: https://datasheet.ciiva.com/11810/0900766b80eb1d8c-11810561.pdf?src-supplier=RSComponents; ComponentLink2URL: https://datasheet.ciiva.com/30178/54aoa0000ce26-30178106.pdf?src-supplier=Onlinecomponents.com; ComponentLink2Description: https://datasheet.ciiva.com/30178/54aoa0000ce26-30178106.pdf?src-supplier=Onlinecomponents.com; ComponentLink3URL: https://datasheet.ciiva.com/9189/aoa0000ce26-9189019.pdf?src-supplier=Avnet; ComponentLink3Description: https://datasheet.ciiva.com/9189/aoa0000ce26-9189019.pdf?src-supplier=Avnet; ComponentLink4URL: https://datasheet.ciiva.com/5968/485442-5968877.pdf?src-supplier=Farnell; ComponentLink4Description: https://datasheet.ciiva.com/5968/485442-5968877.pdf?src-supplier=Farnell; ComponentLink5URL: https://datasheet.ciiva.com/7861/485442-7861694.pdf?src-supplier=Element14; ComponentLink5Description: https://datasheet.ciiva.com/7861/485442-7861694.pdf?src-supplier=Element14; ComponentLink6URL: https://datasheet.ciiva.com/5968/485442-5968879.pdf?src-supplier=Farnell; ComponentLink6Description: https://datasheet.ciiva.com/5968/485442-5968879.pdf?src-supplier=Farnell; ComponentLink7URL: https://datasheet.ciiva.com/7861/485442-7861695.pdf?src-supplier=Element14; ComponentLink7Description: https://datasheet.ciiva.com/7861/485442-7861695.pdf?src-supplier=Element14; ComponentLink8URL: https://datasheet.ciiva.com/41450/001180914-da-01-en-widerstand-era-0603-51k1-0-1-5000st-41450231.pdf?src-supplier=Conrad; ComponentLink8Description: https://datasheet.ciiva.com/41450/001180914-da-01-en-widerstand-era-0603-51k1-0-1-5000st-41450231.pdf?src-supplier=Conrad; Supplier Part Number 1: 4064227
T1 = 750314597: XFRMR ISOL BUCK DC/DC CONV SMD; Manufacturer: Wurth Electronics Midcom; Frequency: 150kHz; Supplier 1: Digi-Key; Manufacturer Part Number: 750314597; RoHS: Yes; Category: Power Supply Modules; Stock 1: 1132; Pricing 1: 1=3.57000, 10=3.30600, 50=3.00500, 100=2.73200 (USD); Mount: Surface Mount; Min Operating Temperature: -40°C; Max Operating Temperature: 125°C; Packaging: Tape and Reel; RoHS Compliant: No; ComponentLink1URL: http://www.mouser.com/ds/2/445/750314597-773587.pdf?src-supplier=Mouser; ComponentLink1Description: http://www.mouser.com/ds/2/445/750314597-773587.pdf?src-supplier=Mouser; ComponentLink2URL: https://katalog.we-online.de/ctm/datasheet/750314597.pdf?src-supplier=Digi-Key; ComponentLink2Description: https://katalog.we-online.de/ctm/datasheet/750314597.pdf?src-supplier=Digi-Key; Supplier Part Number 1: 1297-1165-1-ND
U1 = LM5160ADNTR: IC REG BUCK FLYBCK ADJ 12WSON; Manufacturer: Texas Instruments; Number of Outputs: 1; Min Input Voltage: 4.5V; Max Input Voltage: 65V; Min Output Voltage: 2V; Max Output Voltage: 60V; Output Current: 1.5A; Switching Frequency: 1MHz; Synchronous Rectifier: Yes; Quiescent Current: 2.3mA; Topology: Flyback; Output Type: Adjustable; Supplier 1: Digi-Key; Manufacturer Part Number: LM5160ADNTR; RoHS: Yes; Category: Power Supply Modules; Pricing 1: 1=5.87000, 10=5.27300, 25=4.98480, 100=4.32000, 250=4.09848, 500=3.67756 (USD); Mount: Surface Mount; Min Operating Temperature: -40°C; Max Operating Temperature: 125°C; Packaging: Tape and Reel; Lead Free: Lead Free; RoHS Compliant: Yes; ComponentLink1URL: http://www.ti.com/lit/ds/symlink/lm5160a.pdf?src-supplier=Digi-Key; ComponentLink1Description: http://www.ti.com/lit/ds/symlink/lm5160a.pdf?src-supplier=Digi-Key; ComponentLink2URL: http://www.ti.com/general/docs/suppproductinfo.tsp?distId=10&amp;gotoUrl=http%3A%2F%2Fwww.ti.com%2Flit%2Fgpn%2Flm5160a&src-supplier=Digi-Key; ComponentLink2Description: http://www.ti.com/general/docs/suppproductinfo.tsp?distId=10&amp;gotoUrl=http%3A%2F%2Fwww.ti.com%2Flit%2Fgpn%2Flm5160a&src-supplier=Digi-Key; Supplier Part Number 1: 296-46121-6-ND
U2 = AP63203WU-7: IC REG BUCK 3.3V 2A TSOT26; Manufacturer: Diodes; Supplier: Future Electronics; Supplier Part Number: 6109504; Manufacturer Part Number: AP63203WU-7; RoHS: Yes; Category: Voltage Regulators - Switching; Stock: 3000; Pricing: 3000=0.34, 6000=0.335, 9000=0.33, 12000=0.33, 15000=0.32 (USD); ComponentLink1URL: https://www.diodes.com/assets/Datasheets/AP63200-AP63201-AP63203-AP63205.pdf?src-supplier=Digi-Key; ComponentLink1Description: https://www.diodes.com/assets/Datasheets/AP63200-AP63201-AP63203-AP63205.pdf?src-supplier=Digi-Key; LCSC Part Number: C780769; Item Type: IC
U4 = TPS60150DRVR: IC REG CHARGE PUMP 5V 140MA 6SON; Manufacturer: Texas Instruments; Number of Outputs: 1; Max Input Voltage: 5.5V; Min Input Voltage: 2.7V; Switching Frequency: 1.5MHz; Synchronous Rectifier: No; Min Output Voltage: 4.8V; Quiescent Current: 4.7mA; Max Output Voltage: 5.2V; Output Type: Fixed; Nominal Supply Current: 90uA; Topology: Boost; Supplier 1: Digi-Key; Manufacturer Part Number: TPS60150DRVR; RoHS: Yes; Category: Voltage Regulators - Switching; Pricing 1: 1=1.69000, 10=1.51400, 25=1.42840, 100=1.21700, 250=1.14268, 500=0.99984, 1000=0.94325 (USD); Case/Package: SON; Number of Pins: 6; Contact Plating: Gold; Min Operating Temperature: -40°C; Max Operating Temperature: 85°C; Packaging: Tape and Reel; Output Voltage: 5V; Output Current: 140mA; Package Quantity: 1; Max Output Current: 140mA; Series: -; Max Supply Voltage: 5.5V; Min Supply Voltage: 2.7V; Nominal Output Voltage: 5V; Supply Current: 90uA; Radiation Hardening: No; REACH SVHC: No SVHC; Lead Free: Lead Free; RoHS Compliant: Yes; ComponentLink1URL: https://datasheet.ciiva.com/15114/getdatasheetpartid-358100-15114131.pdf?src-supplier=Verical; ComponentLink1Description: https://datasheet.ciiva.com/15114/getdatasheetpartid-358100-15114131.pdf?src-supplier=Verical; ComponentLink2URL: https://datasheet.ciiva.com/4874/slvs888b-120916-4874885.pdf?src-supplier=Mouser; ComponentLink2Description: https://datasheet.ciiva.com/4874/slvs888b-120916-4874885.pdf?src-supplier=Mouser; ComponentLink3URL: https://datasheet.ciiva.com/26902/tps60150drvr-26902693.pdf?src-supplier=IIIC; ComponentLink3Description: https://datasheet.ciiva.com/26902/tps60150drvr-26902693.pdf?src-supplier=IIIC; ComponentLink4URL: https://datasheet.ciiva.com/41462/001014874-da-01-en-ic-reg-switched-tps60150drvr-wson-6-tid-41462718.pdf?src-supplier=Conrad; ComponentLink4Description: https://datasheet.ciiva.com/41462/001014874-da-01-en-ic-reg-switched-tps60150drvr-wson-6-tid-41462718.pdf?src-supplier=Conrad; ComponentLink5URL: https://datasheet.ciiva.com/22669/1828381-22669637.pdf?src-supplier=Element14; ComponentLink5Description: https://datasheet.ciiva.com/22669/1828381-22669637.pdf?src-supplier=Element14; ComponentLink6URL: https://datasheet.ciiva.com/2025/tps60150-2025302.pdf?src-supplier=Digi-Key; ComponentLink6Description: https://datasheet.ciiva.com/2025/tps60150-2025302.pdf?src-supplier=Digi-Key; ComponentLink7URL: https://datasheet.ciiva.com/2025/tps60150-2025303.pdf?src-supplier=Digi-Key; ComponentLink7Description: https://datasheet.ciiva.com/2025/tps60150-2025303.pdf?src-supplier=Digi-Key; ComponentLink8URL: https://datasheet.ciiva.com/2025/tps60150-2025304.pdf?src-supplier=Digi-Key; ComponentLink8Description: https://datasheet.ciiva.com/2025/tps60150-2025304.pdf?src-supplier=Digi-Key; ComponentLink9URL: https://datasheet.ciiva.com/46382/1828381-46382472.pdf?src-supplier=Element14; ComponentLink9Description: https://datasheet.ciiva.com/46382/1828381-46382472.pdf?src-supplier=Element14; ComponentLink10URL: https://datasheet.ciiva.com/3215/tps60150-3215851.pdf?src-supplier=Avnet; ComponentLink10Description: https://datasheet.ciiva.com/3215/tps60150-3215851.pdf?src-supplier=Avnet; ComponentLink11URL: https://datasheet.ciiva.com/14320/tps60150-14320303.pdf?src-supplier=Avnet; ComponentLink11Description: https://datasheet.ciiva.com/14320/tps60150-14320303.pdf?src-supplier=Avnet; Supplier Part Number 1: 296-24054-6-ND